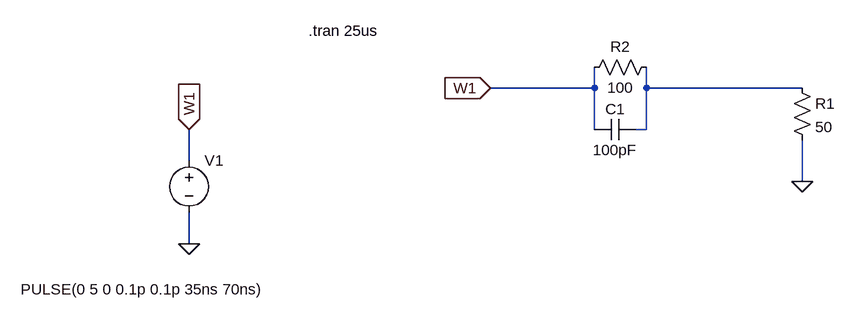
[diagram p0: schematic Sharpen-Pulses.asc]
Sharpen-Pulses.asc, the LTspice schematic file:
Version 4
SHEET 1 1332 680
WIRE -48 -272 -48 -304
WIRE -48 -272 -208 -272
WIRE 32 -272 32 -304
WIRE 272 -272 32 -272
WIRE -48 -208 -48 -272
WIRE 32 -208 32 -272
WIRE 32 -208 16 -208
WIRE -672 -160 -672 -208
WIRE 272 -128 272 -192
WIRE -672 -32 -672 -80
FLAG -208 -272 W1
IOPIN -208 -272 In
FLAG -672 -32 0
FLAG -672 -208 W1
IOPIN -672 -208 In
FLAG 272 -128 0
SYMBOL voltage -672 -176 R0
WINDOW 3 -259 214 Left 2
WINDOW 123 0 0 Left 0
WINDOW 39 0 0 Left 0
SYMATTR Value PULSE(0 5 0 0.1p 0.1p 35ns 70ns)
SYMATTR InstName V1
SYMBOL res 256 -288 R0
SYMATTR InstName R1
SYMATTR Value 50
SYMBOL res 48 -320 R90
WINDOW 0 0 56 VBottom 2
WINDOW 3 32 56 VTop 2
SYMATTR InstName R2
SYMATTR Value 100
SYMBOL cap 16 -224 R90
WINDOW 0 0 32 VBottom 2
WINDOW 3 32 32 VTop 2
SYMATTR InstName C1
SYMATTR Value 100pF
TEXT -488 -360 Left 2 !.tran 25us

The netlist it stands for:
* Sharpen-Pulses.asc
V1 W1 0 PULSE(0 5 0 0.1p 0.1p 35ns 70ns)
R1 N001 0 50
R2 N001 W1 100
C1 N001 W1 100pF
.tran 25us
.backanno
.end